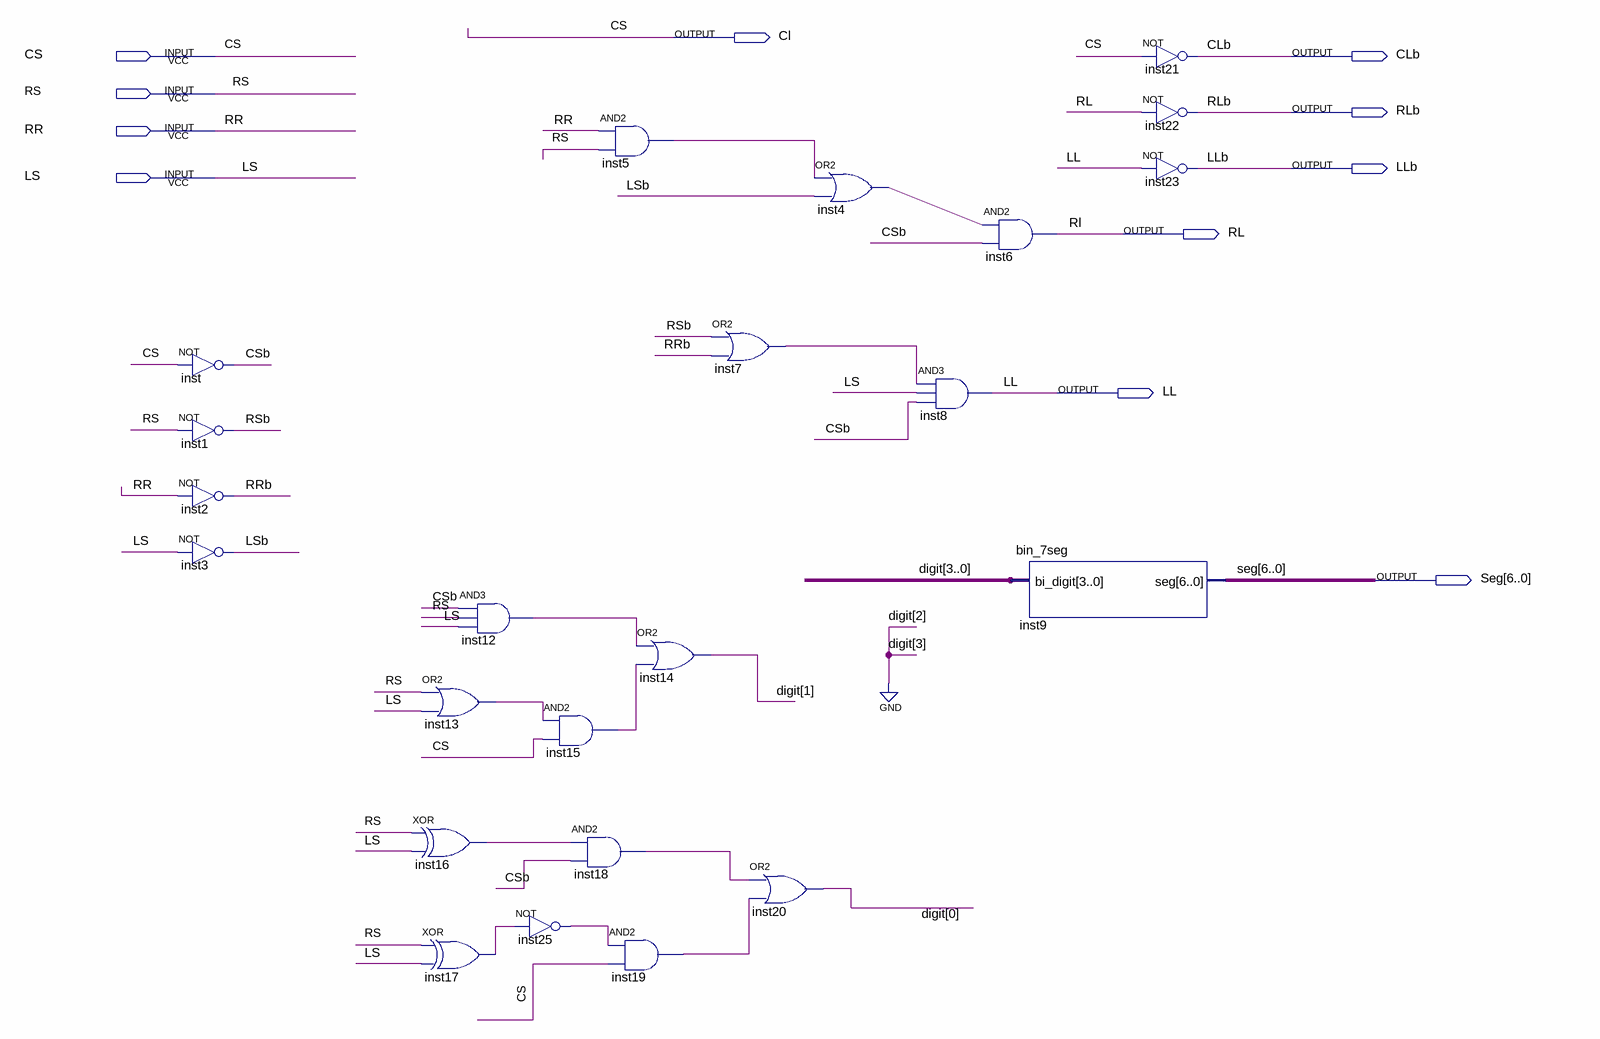
[diagram p0: schematic sheet]
// Quartus schematic traficlight.bdf as structural Verilog: 23 symbols, 11 pins
module traficlight (
  input  CS,
  input  RS,
  input  RR,
  input  LS,
  output Cl,
  output CLb,
  output RLb,
  output LLb,
  output RL,
  output LL,
  output [6:0] Seg
);

  wire CSb, inst4_out, inst5_out, inst7_out, inst12_out, inst13_out, inst15_out, inst16_out, inst17_out,
       inst18_out, inst19_out, inst25_out, LSb, RRb, RSb;
  wire [1:0] digit;

  not inst (CSb, CS);
  not inst1 (RSb, RS);
  not inst2 (RRb, RR);
  not inst3 (LSb, LS);
  and inst12 (inst12_out, CSb, RS, LS);
  or inst13 (inst13_out, RS, LS);
  xor inst16 (inst16_out, RS, LS);
  xor inst17 (inst17_out, RS, LS);
  not inst25 (inst25_out, inst17_out);
  and inst5 (inst5_out, RR, RS);
  and inst15 (inst15_out, inst13_out, CS);
  and inst18 (inst18_out, inst16_out, CSb);
  and inst19 (inst19_out, inst25_out, CS);
  or inst14 (digit[1], inst12_out, inst15_out);
  or inst7 (inst7_out, RSb, RRb);
  or inst20 (digit[0], inst18_out, inst19_out);
  or inst4 (inst4_out, inst5_out, LSb);
  and inst6 (RL, inst4_out, CSb);
  and inst8 (LL, inst7_out, LS, CSb);
  bin_7seg inst9 (.bi_digit({2'b00, digit}), .seg(Seg));
  not inst21 (CLb, CS);
  not inst22 (RLb, RL);
  not inst23 (LLb, LL);

  assign Cl = CS;
endmodule
